# Altium project M7_DSP.PrjPcb (part 1 of 2)
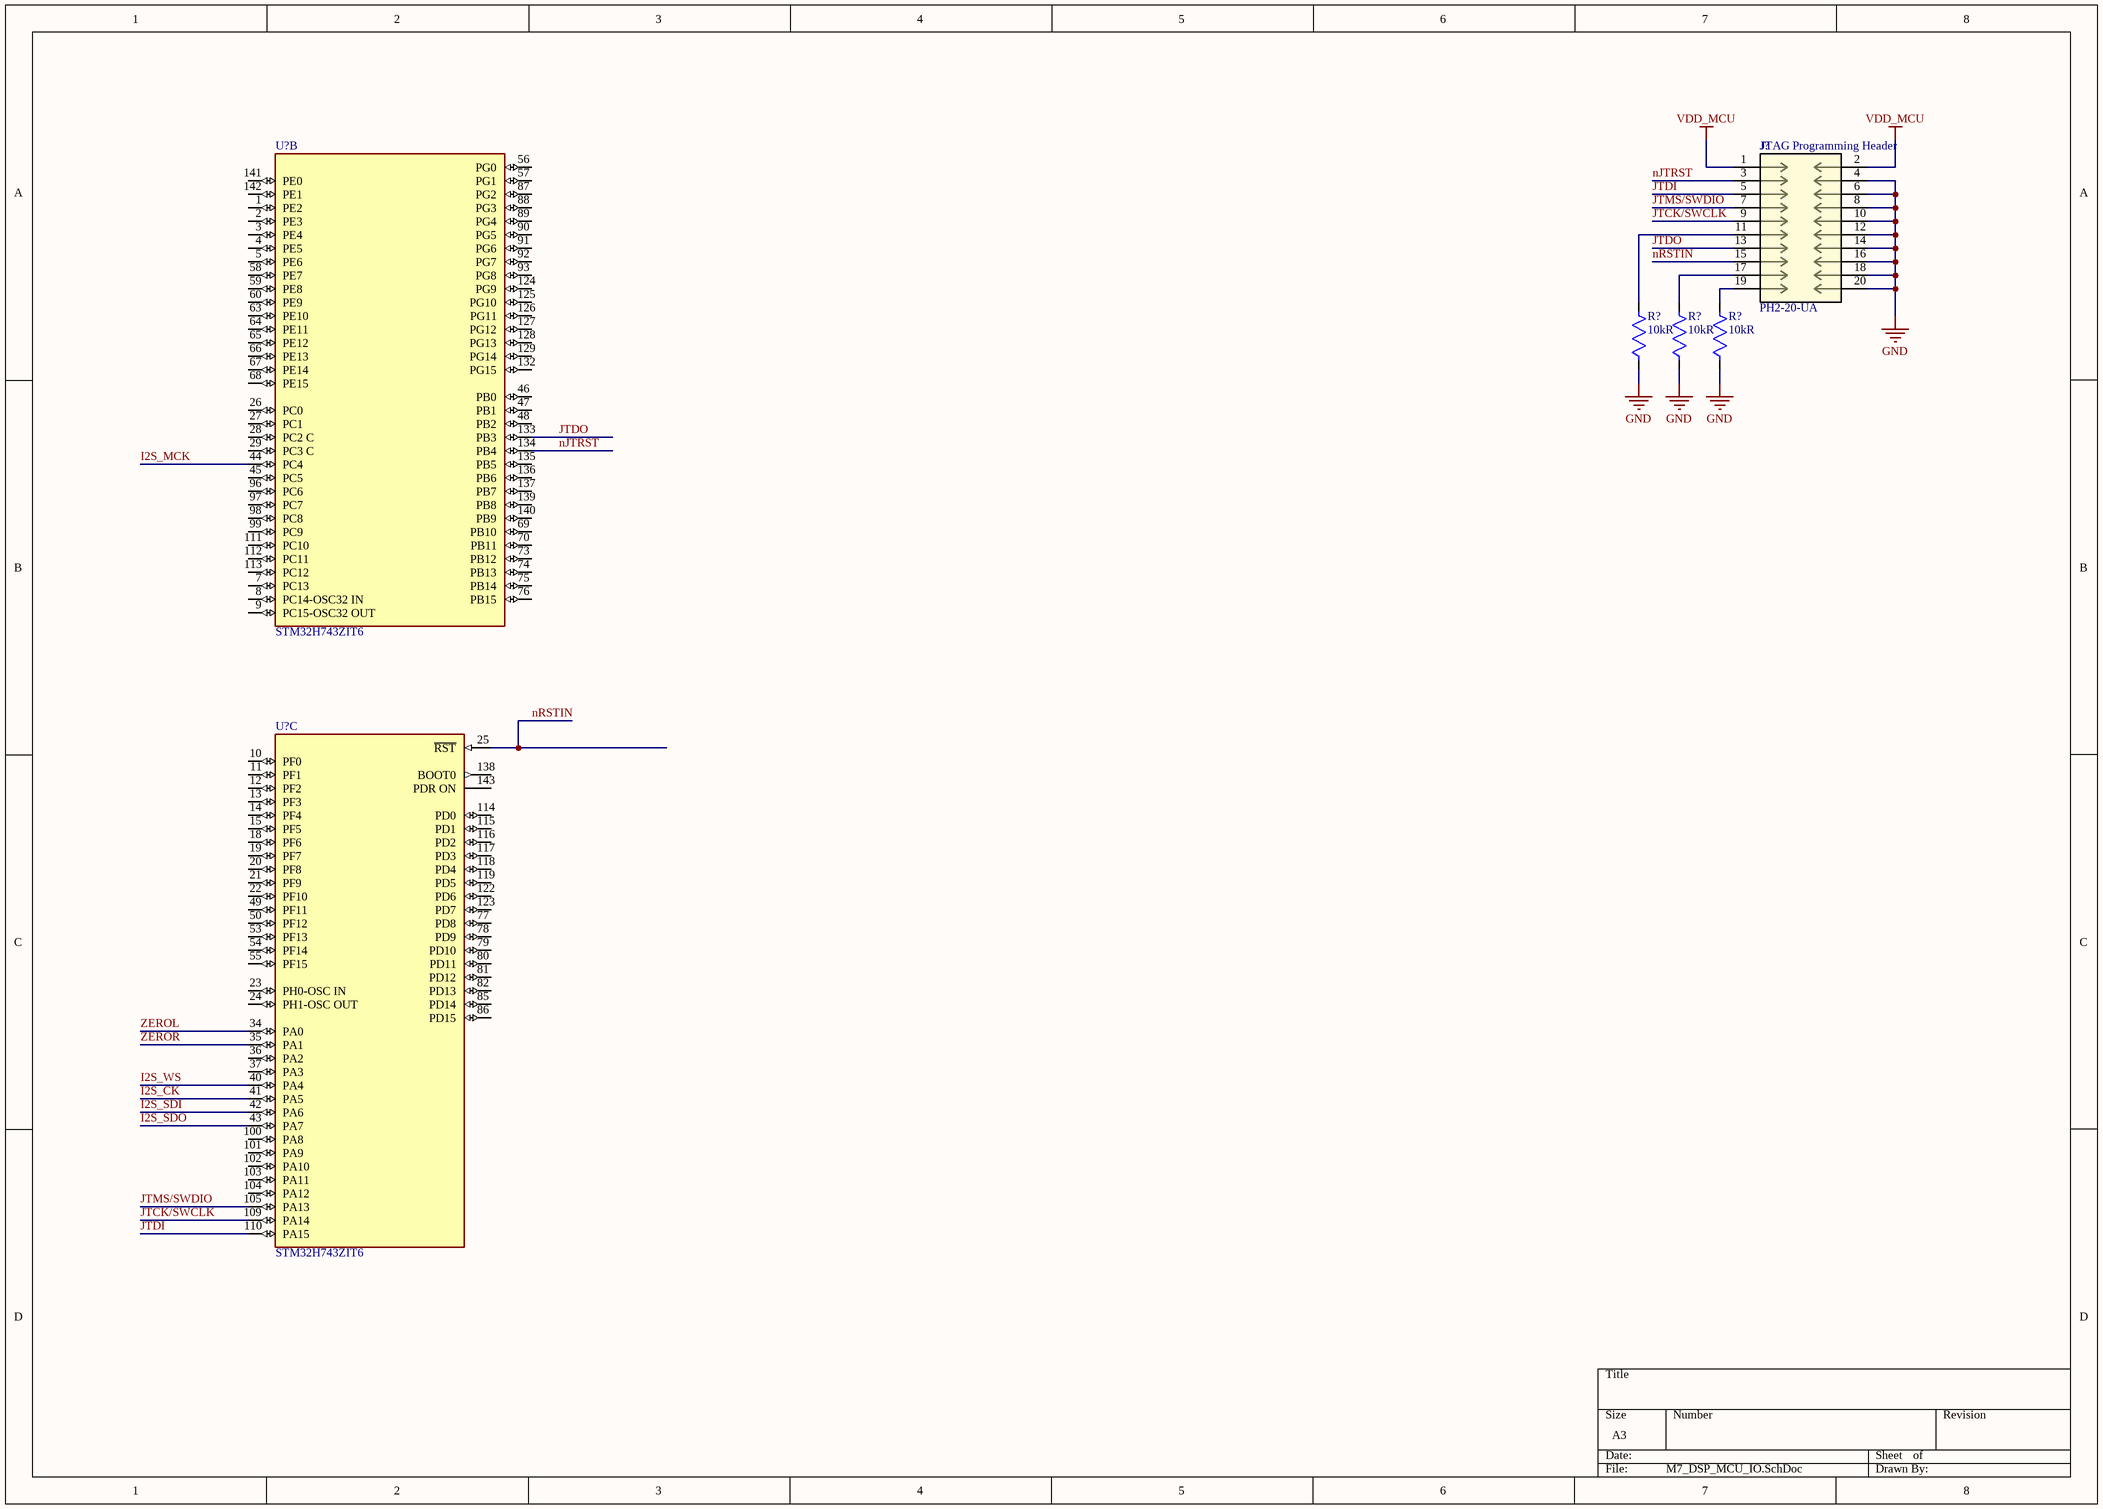
[diagram p0: M7_DSP_MCU_IO.SchDoc]
5 sheets, 96 parts. Net scope: global (net labels, ports and power ports of the same name join across sheets).
Sheets:
  M7_DSP_MCU_IO.SchDoc
  M7_DSP_MCU_Power.SchDoc
  M7_DSP_Power_Supply.SchDoc
  M7_DSP_Top_Sheet.SchDoc
  M7_DSP_Codec.SchDoc

## Sheet M7_DSP_MCU_IO.SchDoc
size A3; SheetNumber: 1; SheetTotal: 5

### Parts
(Parts that share a designator on the sheet are numbered #1, #2 ... from top to bottom, then left to right.)
J?  PH2-20-UA  [CONN_PH2-20-UA_ADM]
R?#1  Resistance: 10kR  [FP-AC0603-MFG]  (hidden comment: AC0603FR-0710KL)
R?#2  Resistance: 10kR  [FP-AC0603-MFG]  (hidden comment: AC0603FR-0710KL)
R?#3  Resistance: 10kR  [FP-AC0603-MFG]  (hidden comment: AC0603FR-0710KL)
U?#1  STM32H743ZIT6  [FP-LQFP144-1A-IPC_A]  (part B of 3)
U?#2  STM32H743ZIT6  [FP-LQFP144-1A-IPC_A]  (part C of 3)

### Nets
GND: J?.4 J?.6 J?.8 J?.10 J?.12 J?.14 J?.16 J?.18 J?.20 R?#1.1 R?#2.1 R?#3.1  [project net AGND]
VDD_MCU: J?.1 J?.2  [project net +3V3]
I2S_CK: U?#2.41(PA5)
I2S_MCK: U?#1.44(PC4)
I2S_SDI: U?#2.42(PA6)
I2S_SDO: U?#2.43(PA7)
I2S_WS: U?#2.40(PA4)
JTCK/SWCLK: J?.9 U?#2.109(PA14)
JTDI: J?.5 U?#2.110(PA15)
JTDO: J?.13 U?#1.133(PB3)
JTMS/SWDIO: J?.7 U?#2.105(PA13)
nJTRST: J?.3 U?#1.134(PB4)
nRSTIN: J?.15 U?#2.25(~{RST})
ZEROL: U?#2.34(PA0)
ZEROR: U?#2.35(PA1)
NetJ?_11: J?.11 R?#1.2
NetJ?_17: J?.17 R?#2.2
NetJ?_19: J?.19 R?#3.2

Not connected (* = marked no-connect by the designer): U?#1 1(PE2) 2(PE3) 3(PE4) 4(PE5) 5(PE6) 7(PC13) 8(PC14-OSC32_IN) 9(PC15-OSC32_OUT) 26(PC0) 27(PC1) 28(PC2_C) 29(PC3_C) 45(PC5) 46(PB0) 47(PB1) 48(PB2) 56(PG0) 57(PG1) 58(PE7) 59(PE8) 60(PE9) 63(PE10) 64(PE11) 65(PE12) 66(PE13) 67(PE14) 68(PE15) 69(PB10) 70(PB11) 73(PB12) 74(PB13) 75(PB14) 76(PB15) 87(PG2) 88(PG3) 89(PG4) 90(PG5) 91(PG6) 92(PG7) 93(PG8) 96(PC6) 97(PC7) 98(PC8) 99(PC9) 111(PC10) 112(PC11) 113(PC12) 124(PG9) 125(PG10) 126(PG11) 127(PG12) 128(PG13) 129(PG14) 132(PG15) 135(PB5) 136(PB6) 137(PB7) 139(PB8) 140(PB9) 141(PE0) 142(PE1); U?#2 10(PF0) 11(PF1) 12(PF2) 13(PF3) 14(PF4) 15(PF5) 18(PF6) 19(PF7) 20(PF8) 21(PF9) 22(PF10) 23(PH0-OSC_IN) 24(PH1-OSC_OUT) 36(PA2) 37(PA3) 49(PF11) 50(PF12) 53(PF13) 54(PF14) 55(PF15) 77(PD8) 78(PD9) 79(PD10) 80(PD11) 81(PD12) 82(PD13) 85(PD14) 86(PD15) 100(PA8) 101(PA9) 102(PA10) 103(PA11) 104(PA12) 114(PD0) 115(PD1) 116(PD2) 117(PD3) 118(PD4) 119(PD5) 122(PD6) 123(PD7) 138(BOOT0) 143(PDR_ON)

### Notes on the sheet
- (near J?) JTAG Programming Header

### Library data of the parts
J? = PH2-20-UA: Conn Unshrouded Header HDR 15 POS 2.54mm Solder ST Thru-Hole Bag; Mfr_Name: ADAM TECHNOLOGIES INC; Manufacturer: Adam Equipment; Number of Positions: 20; Type: DEV; Copyright: Copyright (C) 2024 Ultra Librarian. All rights reserved.; Manufacturer_Part_Number: PH2-20-UA; RefDes: RefDes; Supplier 1: Future Electronics; Manufacturer Part Number: PH2-20-UA; RoHS: Yes; Category: Connectors; Pricing 1: 1000=0.132, 3000=0.128, 5000=0.126, 15000=0.122, 25000=0.119 (USD); Mounting Technology: Through Hole; Contact Plating: Gold; Termination: Solder; Packaging: Bag; Pitch: 2.54mm; Lead Free: Lead Free; ComponentLink1URL: https://datasheet.ciiva.com/16479/page-312-315-16479356.pdf?src-supplier=Future+Electronics; ComponentLink1Description: https://datasheet.ciiva.com/16479/page-312-315-16479356.pdf?src-supplier=Future+Electronics; Supplier Part Number 1: 2074617
R?#1-R?#3 = CMP-2000-04818-3: RES 10KΩ 1.00% 0.1W 0603; Power Rating: 100mW; Tolerance: 1%; Voltage Rating: 50V; Temperature Coefficient: 100ppm/°C; Ratings: AEC-Q200; Case Code (Metric): 1608; Max Power Dissipation: 100mW; Height: 0.45mm; Package Quantity: 1; Max Operating Temperature: 155°C; Resistor Type: Thick Film; Depth: 0.8mm; RoHS Compliant: Yes; Min Operating Temperature: -55°C; Packaging: Tape and Reel; Number of Terminations: 2; Length: 1.6mm; Features: Moisture Resistant; Military Standard: Not; Case Code (Imperial): 0603; Size Code: 0603; Termination: SMD/SMT; Case/Package: 0603; Mount: Surface Mount; Width: 0.8mm; Lead Free: Lead Free; Series: AC; Construction: Rectangular; Supplier 1: Future Electronics; Supplier Part Number 1: 2029400
U?#1 U?#2 = CMP-12105-000003-1: IC MCU 32BIT 2MB FLASH 144LQFP; Manufacturer: STMicroelectronics; Number Of I2C Channels: 4; Number Of A/D Converters: 2; Standoff Height: 0.05mm; Interface: I2C,SPI,UART,USART,EBI/EMI,CAN,USB,LIN,IrDA,Other; Max Supply Voltage: 3.6V; Number Of Adc Channels: 36; Ram Size: 1MBytes; Number Of Cores: 1; Frequency: 400MHz; Data Bus Width: 32bits; Core Architecture: ARM Cortex-M7; Memory Size: 2MBytes; Number Of Timers/Counters: 22; Min Supply Voltage: 1.62V; Number Of Spi Channels: 6; Max Junction Temp: +125°C; Number Of I/Os: 114; Digikey Description: IC MCU 32BIT 2MB FLASH 144LQFP; Device Class L2: Embedded Processors and Controllers; Number Of Usb Channels: 2; ComponentLink2Description: Datasheet; Ipc Land Pattern Name: QFP50P2200X2200X160-144; Category: IC; Lead Free: Yes; Temperature Range High: +85°C; Mouser Description: MCU 32-Bit STM32 ARM Cortex M7 RISC 2MB Flash 1.8V/2.5V/3.3V 144-Pin LQFP Tray; RoHS: TRUE; Ambient Temperature Range Low: -40°C; Temperature Range Low: -40°C; ComponentLink2URL: https://www.st.com/resource/en/datasheet/stm32h743zi.pdf; Ambient Temperature Range High: +85°C; Octopart: https://octopart.com/stm32h743zit6-stmicroelectronics-76372529; Number Of Pwm Channels: 2; Height: 1.6mm; Manufacturer Part Number: STM32H743ZIT6; Device Class L3: Microcontrollers; Device Class L1: Integrated Circuits (ICs); Automotive: No; Memory Type: FLASH; Number Of Uart Channels: 4; Package: LQFP144-1A; Temperature: -40°C to +85°C; Supplier 1: Mouser; Supplier Part Number 1: 511-STM32H743ZIT6

## Sheet M7_DSP_MCU_Power.SchDoc
size A3; SheetNumber: 2; SheetTotal: 5
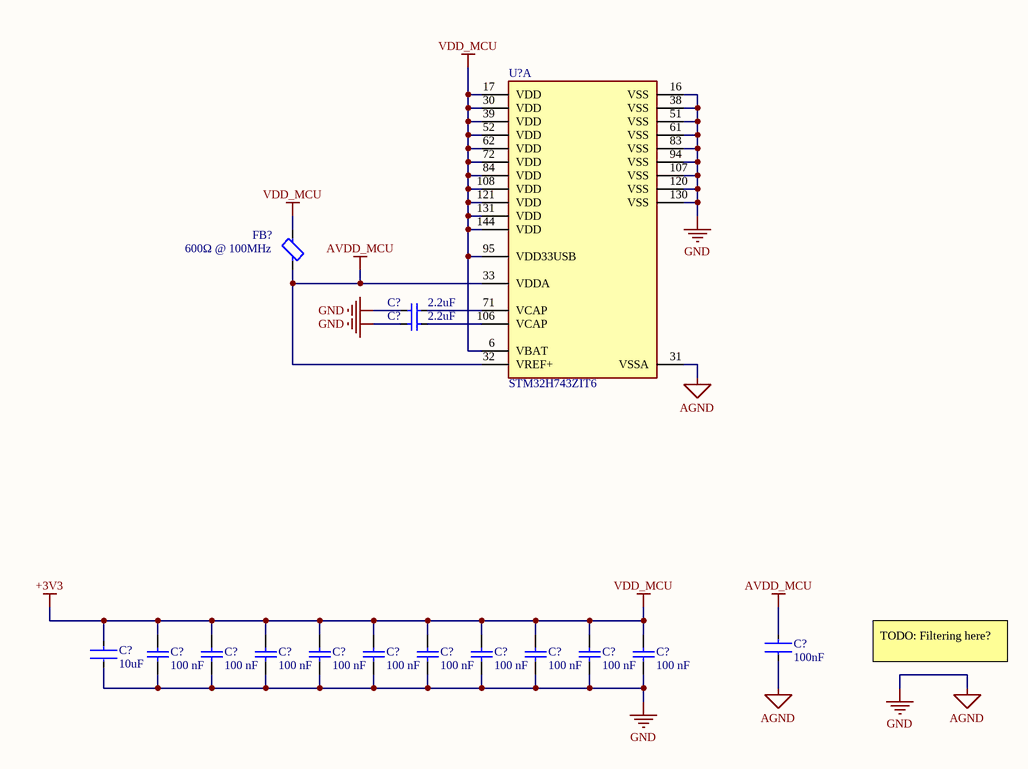
[diagram p1: M7_DSP_MCU_Power.SchDoc]

### Parts
(Parts that share a designator on the sheet are numbered #1, #2 ... from top to bottom, then left to right.)
C?#1  Capacitance: 2.2uF  [FP-CL10-IPC_A]  (hidden comment: CL10A225KO8NNNC)
C?#2  Capacitance: 2.2uF  [FP-CL10-IPC_A]  (hidden comment: CL10A225KO8NNNC)
C?#3  Capacitance: 100 nF  [CAPC1608X90X40ML10T20]  (hidden comment: CC0603ZRY5V9BB104)
C?#4  Capacitance: 100 nF  [CAPC1608X90X40ML10T20]  (hidden comment: CC0603ZRY5V9BB104)
C?#5  Capacitance: 100 nF  [CAPC1608X90X40ML10T20]  (hidden comment: CC0603ZRY5V9BB104)
C?#6  Capacitance: 100 nF  [CAPC1608X90X40ML10T20]  (hidden comment: CC0603ZRY5V9BB104)
C?#7  Capacitance: 100 nF  [CAPC1608X90X40ML10T20]  (hidden comment: CC0603ZRY5V9BB104)
C?#8  Capacitance: 100 nF  [CAPC1608X90X40ML10T20]  (hidden comment: CC0603ZRY5V9BB104)
C?#9  Capacitance: 100 nF  [CAPC1608X90X40ML10T20]  (hidden comment: CC0603ZRY5V9BB104)
C?#10  Capacitance: 100 nF  [CAPC1608X90X40ML10T20]  (hidden comment: CC0603ZRY5V9BB104)
C?#11  Capacitance: 100 nF  [CAPC1608X90X40ML10T20]  (hidden comment: CC0603ZRY5V9BB104)
C?#12  Capacitance: 100 nF  [CAPC1608X90X40ML10T20]  (hidden comment: CC0603ZRY5V9BB104)
C?#13  Capacitance: 100nF  [FP-0402-L_1_0_0_05-W_0_5-MFG]  (hidden comment: TMK105B7104MV-FR)
C?#14  value 10uF  [FP-GRM21B-0_2-e0_2_0_7-MFG]  (hidden comment: GRM21BC71E106ME11L)
FB?  MMZ1608B601CTAH0  [FP-MMZ1608-0_6-IPC_C]  (value not drawn)
U?#3  STM32H743ZIT6  [FP-LQFP144-1A-IPC_A]  (part A of 3)

### Nets
+3V3: C?#3.1 C?#4.1 C?#5.1 C?#6.1 C?#7.1 C?#8.1 C?#9.1 C?#10.1 C?#11.1 C?#12.1 C?#14.1 FB?.1 U?#3.6(VBAT) U?#3.17(VDD) U?#3.30(VDD) U?#3.39(VDD) U?#3.52(VDD) U?#3.62(VDD) U?#3.72(VDD) U?#3.84(VDD) U?#3.95(VDD33USB) U?#3.108(VDD) U?#3.121(VDD) U?#3.131(VDD) U?#3.144(VDD)  [also labelled VDD_MCU]
AGND: C?#1.2 C?#2.2 C?#3.2 C?#4.2 C?#5.2 C?#6.2 C?#7.2 C?#8.2 C?#9.2 C?#10.2 C?#11.2 C?#12.2 C?#13.2 C?#14.2 U?#3.16(VSS) U?#3.31(VSSA) U?#3.38(VSS) U?#3.51(VSS) U?#3.61(VSS) U?#3.83(VSS) U?#3.94(VSS) U?#3.107(VSS) U?#3.120(VSS) U?#3.130(VSS)  [also labelled GND]
AVDD_MCU: C?#13.1 FB?.2 U?#3.32(VREF+) U?#3.33(VDDA)
NetC?#1_1: C?#1.1 U?#3.71(VCAP)
NetC?#2_1: C?#2.1 U?#3.106(VCAP)

### Notes on the sheet
- (near FB?) 600Ω @ 100MHz
- TODO: Filtering here?

### Library data of the parts
C?#1 C?#2 = CMP-13271-000835-1: Cap Ceramic 2.2uF 16V X5R ±10% Pad SMD 0603 +85°C T/R; Case Code (Metric): 1608; Height: 0.8mm; Case/Package: 0603; Depth: 0.8mm; Voltage Rating: 16V; Case Code (Imperial): 0603; Length: 1.6mm; Packaging: Tape and Reel; Material: Ceramic; Lead Free: Lead Free; Max Operating Temperature: 85°C; Contact Plating: Tin; Thickness: 0.035inch; Radiation Hardening: No; Tolerance: 10%; Min Operating Temperature: -55°C; Voltage: 16V; Dielectric: X5R; Mount: Surface Mount; Package Quantity: 4000; Width: 0.031inch; Voltage Rating (DC): 16V; Supplier 1: Rs; Supplier Part Number 1: 7664799
C?#3-C?#12 = CMP-1035-02594-2: Chip Capacitor, 100 nF, - 20% to + 80%, 50 V, -30 to 85 degC, 0603 (1608 Metric), RoHS, Tape and Reel; Manufacturer: Yageo; Tolerance: -20%,+80%; Product Training Modules: MultilayerCeramicCapacitors; Temperature Coefficient: Y5V(F); Kits: CC060300000000000-ND-MLCC0603SAMPLEKIT; Other Names: 311-1343-1; Featured Product: CommodityMultilayerCeramicCapacitors–CCSeries; Online Catalog: CCSeries; Voltage - Rated: 50V; Mounting Type: SurfaceMount,MLCC; Package Description: 2-Pin Surface Mount Device, Body 1.6 x 0.8 mm; Ratings: -; Lead Spacing: -; Standard Package: 1; Applications: GeneralPurpose; Size / Dimension: 0.063"Lx0.031"W(1.60mmx0.80mm); Package Reference: 0603; Operating Temperature: -30°C~85°C; Features: -; Height - Seated (Max): -; Thickness (Max): 0.035"(0.90mm); Series: CC; Datasheet URL: https://datasheet.ciiva.com/17434/upy-gphc-y5v-6-3v-to-50v-5-17434523.pdf; Family: CeramicCapacitors; Mounting Technology: SurfaceMount; Packaging: CutTape(CT); Package / Case: 0603(1608Metric); Manufacturer URL: http://www.yageo.com/; Category: Capacitors; Lead Style: -; Datasheet Version: Rev. 5, 07/2010; Supplier 1: Rs; Supplier Part Number 1: 6169565
C?#13 = CMP-14477-003834-2: Multilayer Ceramic Capacitors (High dielectric type), 25V, 0.1 uF, ± 20 %, 0402, X7R, RoHS; Manufacturer: Taiyo Yuden; Tolerance: 20%; Value: 100nF; Min Operating Temperature: -55°C; Voltage Rating: 25V; Max Operating Temperature: 125°C; Mount: Surface Mount; RoHS Compliant: Yes; Case/Package: 0402; Packaging: Tape and Reel; Supplier 1: Avnet; Manufacturer Part Number: TMK105B7104MV-FR; RoHS: Yes; Category: Ceramic Capacitors; Stock 1: 20000; Pricing 1: 10000=0.00533, 20000=0.00524, 40000=0.00515, 60000=0.00506, 80000=0.00497 (USD); Mounting Technology: Surface Mount; Series: M; ComponentLink1URL: http://ds.yuden.co.jp/TYCOMPAS/ut/detail.do?productNo=TMK105B7104MV-FR&amp;fileName=TMK105B7104MV-FR_SS&amp;mode=specSheetDownload&src-supplier=Digikey; ComponentLink1Description: http://ds.yuden.co.jp/TYCOMPAS/ut/detail.do?productNo=TMK105B7104MV-FR&amp;fileName=TMK105B7104MV-FR_SS&amp;mode=specSheetDownload&src-supplier=Digikey; Supplier Part Number 1: TMK105B7104MV-FR
C?#14 = GRM21BC71E106ME11L: Multilayer Ceramic Capacitors MLCC - SMD/SMT 0805 10uF 25volts *Derate Voltage/Temp; Manufacturer: Murata; Voltage Rating: 25V; Tolerance: 20%; Dielectric: X7S; Manufacturer Part Number: GRM21BC71E106ME11L; RoHS: Yes; Category: Ceramic Capacitors; Stock 1: 6000; Pricing 1: 3000=0.1097, 9000=0.0994, 24000=0.097, 45000=0.0923 (USD); Mounting Technology: Surface Mount; Case/Package: 0805; Case Code (Metric): 2012; Case Code (Imperial): 0805; Weight: 0.000335oz; Min Operating Temperature: -55°C; Max Operating Temperature: 125°C; Packaging: Tape and Reel; Termination: SMD/SMT; Voltage Rating (DC): 25V; Package Quantity: 3000; Series: GRM; Length: 0.079inch; Width: 0.049inch; Height: 1.25mm; Thickness: 0.057inch; RoHS Compliant: Yes; ComponentLink1URL: http://www.mouser.com/ds/2/281/c02e-2905.pdf?src-supplier=Mouser; ComponentLink1Description: http://www.mouser.com/ds/2/281/c02e-2905.pdf?src-supplier=Mouser; ComponentLink2URL: http://search.murata.co.jp/Ceramy/image/img/A01X/G101/ENG/GRM21BC71E106ME11-01.pdf?src-supplier=Digikey; ComponentLink2Description: http://search.murata.co.jp/Ceramy/image/img/A01X/G101/ENG/GRM21BC71E106ME11-01.pdf?src-supplier=Digikey; ComponentLink3URL: http://search.murata.co.jp/Ceramy/image/img/A01X/partnumbering_e_01.pdf?src-supplier=Digikey; ComponentLink3Description: http://search.murata.co.jp/Ceramy/image/img/A01X/partnumbering_e_01.pdf?src-supplier=Digikey; ComponentLink4URL: https://datasheet.octopart.com/GRM21BC71E106ME11L-Murata-datasheet-149523451.pdf?src-supplier=Newark; ComponentLink4Description: https://datasheet.octopart.com/GRM21BC71E106ME11L-Murata-datasheet-149523451.pdf?src-supplier=Newark; ComponentLink5URL: https://datasheet.octopart.com/GRM21BC71E106ME11L-Murata-datasheet-32479577.pdf?src-supplier=Future+Electronics; ComponentLink5Description: https://datasheet.octopart.com/GRM21BC71E106ME11L-Murata-datasheet-32479577.pdf?src-supplier=Future+Electronics; Supplier Part Number 1: GRM21BC71E106ME11L; Supplier 1: Arrow Electronics
FB? = CMP-08257-000106-1: Signal Line Ferrite Bead 600 Ω 100MHz 500mA DCR 400mΩ SMD 0603; Tolerance: 25%; Impedance: 600R; DC Resistance (DCR): 400mR; Packaging: Cut Tape; Depth: 0.8mm; Case Code (Metric): 1608; Mount: Surface Mount; REACH SVHC: No SVHC; Case/Package: 0603; Max DC Current: 500mA; Height: 0.03inch; Case Code (Imperial): 0603; Package Quantity: 1; RoHS Compliant: Yes; Core Material: Ferrite; Length: 0.063inch; Current Rating: 500mA; Width: 0.031inch; Supplier 1: Rs; Supplier Part Number 1: 7865015
U?#3 = CMP-12105-000003-1: as U?#1 on sheet M7_DSP_MCU_IO; Digikey Description: IC MCU 32BIT 2MB FLASH 144LQFP; Device Class L2: Embedded Processors and Controllers; Number Of Usb Channels: 2; ComponentLink2Description: Datasheet; Ipc Land Pattern Name: QFP50P2200X2200X160-144; Category: IC; Lead Free: Yes; Temperature Range High: +85°C; Mouser Description: MCU 32-Bit STM32 ARM Cortex M7 RISC 2MB Flash 1.8V/2.5V/3.3V 144-Pin LQFP Tray; RoHS: TRUE; Ambient Temperature Range Low: -40°C; Temperature Range Low: -40°C; ComponentLink2URL: https://www.st.com/resource/en/datasheet/stm32h743zi.pdf; Ambient Temperature Range High: +85°C; Octopart: https://octopart.com/stm32h743zit6-stmicroelectronics-76372529; Number Of Pwm Channels: 2; Height: 1.6mm; Manufacturer Part Number: STM32H743ZIT6; Device Class L3: Microcontrollers; Device Class L1: Integrated Circuits (ICs); Automotive: No; Memory Type: FLASH; Number Of Uart Channels: 4; Package: LQFP144-1A; Temperature: -40°C to +85°C; Supplier 1: Mouser; Supplier Part Number 1: 511-STM32H743ZIT6

## Sheet M7_DSP_Power_Supply.SchDoc
size A3; SheetNumber: 3; SheetTotal: 5
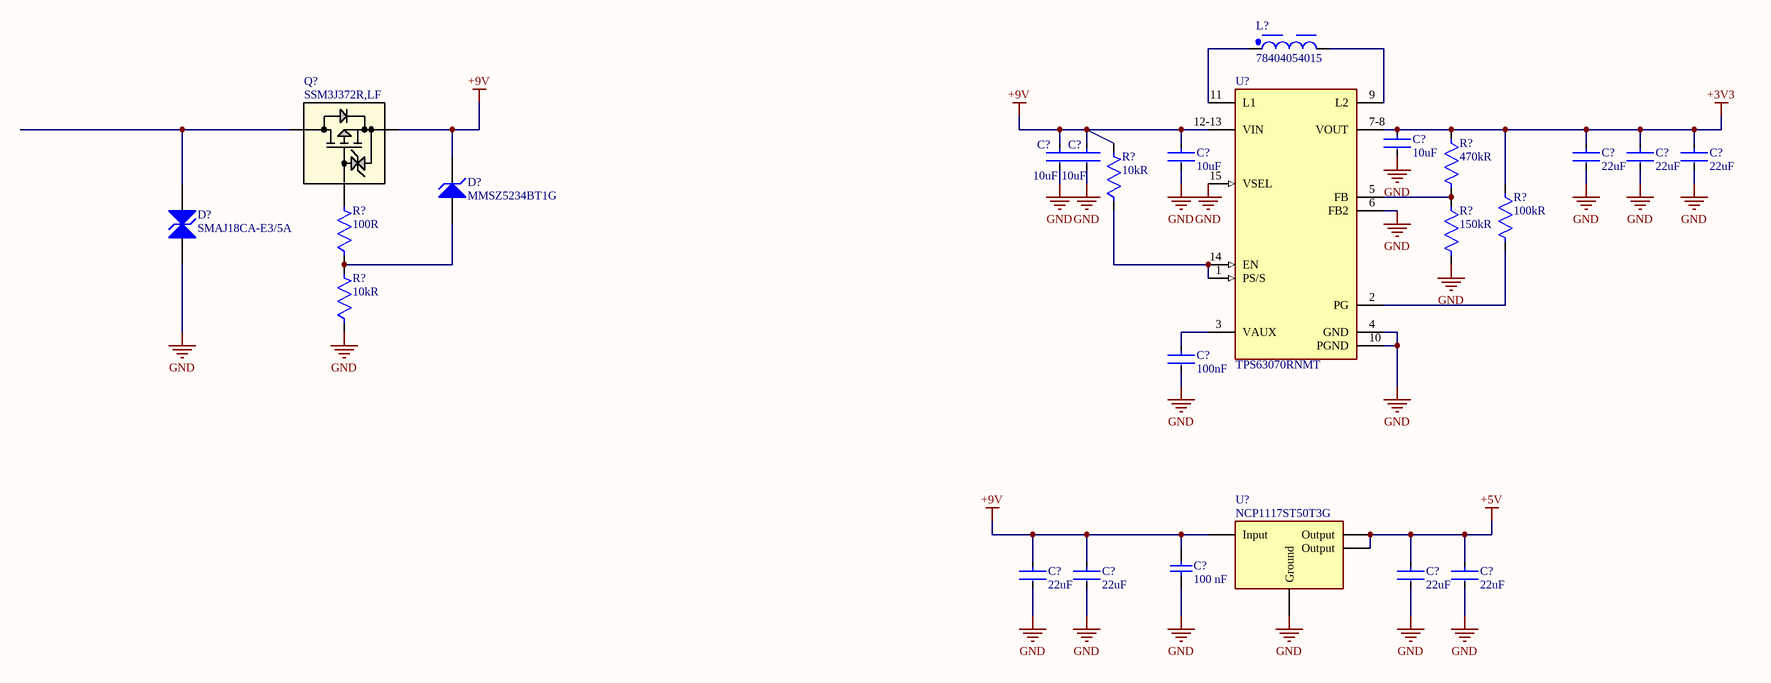
[diagram p2: M7_DSP_Power_Supply.SchDoc]

### Parts
(Parts that share a designator on the sheet are numbered #1, #2 ... from top to bottom, then left to right.)
C?#15  Capacitance: 10uF  [FP-0603-L_1_6_0_2-W_0_8_0-MFG]  (hidden comment: TMK107BBJ106MA-T)
C?#16  value 10uF  [FP-GRM21B-0_2-e0_2_0_7-MFG]  (hidden comment: GRM21BC71E106ME11L)
C?#17  value 10uF  [FP-GRM21B-0_2-e0_2_0_7-MFG]  (hidden comment: GRM21BC71E106ME11L)
C?#18  Capacitance: 10uF  [FP-0603-L_1_6_0_2-W_0_8_0-MFG]  (hidden comment: TMK107BBJ106MA-T)
C?#19  Capacitance: 22uF  [FP-GRM21B-0_2-e0_2_0_7-MFG]  (hidden comment: GRM21BC81C226ME44L)
C?#20  Capacitance: 22uF  [FP-GRM21B-0_2-e0_2_0_7-MFG]  (hidden comment: GRM21BC81C226ME44L)
C?#21  Capacitance: 22uF  [FP-GRM21B-0_2-e0_2_0_7-MFG]  (hidden comment: GRM21BC81C226ME44L)
C?#22  Capacitance: 100nF  [FP-0402-L_1_0_0_05-W_0_5-MFG]  (hidden comment: TMK105B7104MV-FR)
C?#23  Capacitance: 100 nF  [CAPC1608X90X40ML10T20]  (hidden comment: CC0603ZRY5V9BB104)
C?#24  Capacitance: 22uF  [FP-GRM21B-0_2-e0_2_0_7-MFG]  (hidden comment: GRM21BC81C226ME44L)
C?#25  Capacitance: 22uF  [FP-GRM21B-0_2-e0_2_0_7-MFG]  (hidden comment: GRM21BC81C226ME44L)
C?#26  Capacitance: 22uF  [FP-GRM21B-0_2-e0_2_0_7-MFG]  (hidden comment: GRM21BC81C226ME44L)
C?#27  Capacitance: 22uF  [FP-GRM21B-0_2-e0_2_0_7-MFG]  (hidden comment: GRM21BC81C226ME44L)
D?#1  MMSZ5234BT1G  [ONSC-SOD-123-2-425-04_V]
D?#2  SMAJ18CA-E3/5A  [VISH-DO-214AC-2_L]
L?  78404054015  [WE-LQSA_5040]
Q?  SSM3J372R,LF  [SOT-23F_TOS]
R?#4  Resistance: 470kR  [FP-AC0603-MFG]  (hidden comment: AC0603FR-07470KL)
R?#5  Resistance: 100kR  [FP-AC0603-MFG]  (hidden comment: AC0603FR-07100KL)
R?#6  Resistance: 150kR  [FP-AC0603-MFG]  (hidden comment: AC0603FR-07150KL)
R?#7  Resistance: 10kR  [FP-AC0603-MFG]  (hidden comment: AC0603FR-0710KL)
R?#8  Resistance: 100R  [FP-AC0603-MFG]  (hidden comment: AC0603FR-07100RL)
R?#9  Resistance: 10kR  [FP-AC0603-MFG]  (hidden comment: AC0603FR-0710KL)
U?#4  TPS63070RNMT  [FP-RNM0015A-MFG]
U?#5  NCP1117ST50T3G  [FP-318H-MFG]

### Nets
+3V3: C?#15.1 C?#19.1 C?#20.1 C?#21.1 R?#4.1 R?#5.1 U?#4.7-8(VOUT)
+5V: C?#26.1 C?#27.1 U?#5.2(Output) U?#5.4(Output)
+9V: C?#16.1 C?#17.1 C?#18.1 C?#23.1 C?#24.1 C?#25.1 D?#1.1(K) Q?.2 R?#7.2 U?#4.12-13(VIN) U?#5.3(Input)
GND: C?#15.2 C?#16.2 C?#17.2 C?#18.2 C?#19.2 C?#20.2 C?#21.2 C?#22.2 C?#23.2 C?#24.2 C?#25.2 C?#26.2 C?#27.2 D?#2.1(A1) R?#6.2 R?#9.1 U?#4.4(GND) U?#4.6(FB2) U?#4.10(PGND) U?#4.15(VSEL) U?#5.1(Ground)  [project net AGND]
NetC?#22_1: C?#22.1 U?#4.3(VAUX)
NetD?#1_2: D?#1.2(A) R?#8.1 R?#9.2
NetD?#2_2: D?#2.2(A2) Q?.3
NetL?_1: L?.1 U?#4.11(L1)
NetL?_2: L?.2 U?#4.9(L2)
NetQ?_1: Q?.1 R?#8.2
NetR?#4_2: R?#4.2 R?#6.1 U?#4.5(FB)
NetR?#5_2: R?#5.2 U?#4.2(PG)
NetR?#7_1: R?#7.1 U?#4.1(PS/S) U?#4.14(EN)

### Library data of the parts
C?#15 C?#18 = CMP-14477-005164-2: Multilayer Ceramic Capacitor 10uF 25V X5R 20% SMD 0603 T/R; Packaging: Tape and Reel; Tolerance: 20%; Mount: Surface Mount; Case Code (Metric): 1608; Case Code (Imperial): 0603; Min Operating Temperature: -55°C; Lead Free: Lead Free; RoHS Compliant: Yes; Case/Package: 0603; Max Operating Temperature: 85°C; Voltage Rating: 25V; Supplier 1: Rs; Supplier Part Number 1: 1782887
C?#16 C?#17 = GRM21BC71E106ME11L: as C?#14 on sheet M7_DSP_MCU_Power; Manufacturer Part Number: GRM21BC71E106ME11L; RoHS: Yes; Category: Ceramic Capacitors; Stock 1: 6000; Pricing 1: 3000=0.1097, 9000=0.0994, 24000=0.097, 45000=0.0923 (USD); Mounting Technology: Surface Mount; Case/Package: 0805; Case Code (Metric): 2012; Case Code (Imperial): 0805; Weight: 0.000335oz; Min Operating Temperature: -55°C; Max Operating Temperature: 125°C; Packaging: Tape and Reel; Termination: SMD/SMT; Voltage Rating (DC): 25V; Package Quantity: 3000; Series: GRM; Length: 0.079inch; Width: 0.049inch; Height: 1.25mm; Thickness: 0.057inch; RoHS Compliant: Yes; ComponentLink1URL: http://www.mouser.com/ds/2/281/c02e-2905.pdf?src-supplier=Mouser; ComponentLink1Description: http://www.mouser.com/ds/2/281/c02e-2905.pdf?src-supplier=Mouser; ComponentLink2URL: http://search.murata.co.jp/Ceramy/image/img/A01X/G101/ENG/GRM21BC71E106ME11-01.pdf?src-supplier=Digikey; ComponentLink2Description: http://search.murata.co.jp/Ceramy/image/img/A01X/G101/ENG/GRM21BC71E106ME11-01.pdf?src-supplier=Digikey; ComponentLink3URL: http://search.murata.co.jp/Ceramy/image/img/A01X/partnumbering_e_01.pdf?src-supplier=Digikey; ComponentLink3Description: http://search.murata.co.jp/Ceramy/image/img/A01X/partnumbering_e_01.pdf?src-supplier=Digikey; ComponentLink4URL: https://datasheet.octopart.com/GRM21BC71E106ME11L-Murata-datasheet-149523451.pdf?src-supplier=Newark; ComponentLink4Description: https://datasheet.octopart.com/GRM21BC71E106ME11L-Murata-datasheet-149523451.pdf?src-supplier=Newark; ComponentLink5URL: https://datasheet.octopart.com/GRM21BC71E106ME11L-Murata-datasheet-32479577.pdf?src-supplier=Future+Electronics; ComponentLink5Description: https://datasheet.octopart.com/GRM21BC71E106ME11L-Murata-datasheet-32479577.pdf?src-supplier=Future+Electronics; Supplier Part Number 1: GRM21BC71E106ME11L; Supplier 1: Arrow Electronics
C?#19-C?#21 C?#24-C?#27 = CMP-06035-012913-1: Chip Multilayer Ceramic Capacitors for General Purpose, 0805, 22uF, X6S, 22%, 20%, 16V; Packaging: Tape and Reel; Dielectric: X6S; Case Code (Imperial): 0805; Weight: 0.000335oz; Case Code (Metric): 2012; Thickness: 0.057inch; Min Operating Temperature: -55°C; Voltage Rating (DC): 16V; Tolerance: 20%; Width: 1.25mm; Voltage Rating: 16V; Mount: Surface Mount; Length: 0.079inch; Lead Free: Lead Free; Case/Package: 0805; Package Quantity: 3000; Height: 1.25mm; Max Operating Temperature: 105°C; Termination: SMD/SMT; Supplier 1: Rs; Supplier Part Number 1: 2478094
C?#22 = CMP-14477-003834-2: as C?#13 on sheet M7_DSP_MCU_Power; Min Operating Temperature: -55°C; Voltage Rating: 25V; Max Operating Temperature: 125°C; Mount: Surface Mount; RoHS Compliant: Yes; Case/Package: 0402; Packaging: Tape and Reel; Supplier 1: Avnet; Manufacturer Part Number: TMK105B7104MV-FR; RoHS: Yes; Category: Ceramic Capacitors; Stock 1: 20000; Pricing 1: 10000=0.00533, 20000=0.00524, 40000=0.00515, 60000=0.00506, 80000=0.00497 (USD); Mounting Technology: Surface Mount; Series: M; ComponentLink1URL: http://ds.yuden.co.jp/TYCOMPAS/ut/detail.do?productNo=TMK105B7104MV-FR&amp;fileName=TMK105B7104MV-FR_SS&amp;mode=specSheetDownload&src-supplier=Digikey; ComponentLink1Description: http://ds.yuden.co.jp/TYCOMPAS/ut/detail.do?productNo=TMK105B7104MV-FR&amp;fileName=TMK105B7104MV-FR_SS&amp;mode=specSheetDownload&src-supplier=Digikey; Supplier Part Number 1: TMK105B7104MV-FR
C?#23 = CMP-1035-02594-2: as C?#3 on sheet M7_DSP_MCU_Power; Mounting Type: SurfaceMount,MLCC; Package Description: 2-Pin Surface Mount Device, Body 1.6 x 0.8 mm; Ratings: -; Lead Spacing: -; Standard Package: 1; Applications: GeneralPurpose; Size / Dimension: 0.063"Lx0.031"W(1.60mmx0.80mm); Package Reference: 0603; Operating Temperature: -30°C~85°C; Features: -; Height - Seated (Max): -; Thickness (Max): 0.035"(0.90mm); Series: CC; Datasheet URL: https://datasheet.ciiva.com/17434/upy-gphc-y5v-6-3v-to-50v-5-17434523.pdf; Family: CeramicCapacitors; Mounting Technology: SurfaceMount; Packaging: CutTape(CT); Package / Case: 0603(1608Metric); Manufacturer URL: http://www.yageo.com/; Category: Capacitors; Lead Style: -; Datasheet Version: Rev. 5, 07/2010; Supplier 1: Rs; Supplier Part Number 1: 6169565
D?#1 = CMP-1060-00589-1: Zener Voltage Regulator, 500 mW, 2-Pin SOD-123, Pb-Free, Tape and Reel; Manufacturer: On Semiconductor; P Max (W): 0.5; VZ Typ (V): 6.2; ComponentLink3Description: Package Specification; PartNumber: MMSZ5234BT1G; ComponentLink2Description: Datasheet; Packing: Tape and Reel; Mounting Technology: Surface Mount; ComponentLink3URL: http://www.onsemi.com/pub_link/Collateral/425-04.PDF; DatasheetVersion: Rev. 12; ComponentLink1Description: Manufacturer URL; PackageDescription: 2-Pin SOD, Body 1.6 x 2.69 mm; PackageVersion: Rev. G, 10/2009; ComponentLink2URL: http://www.onsemi.com/pub_link/Collateral/MMSZ5221BT1-D.PDF; RoHS: Pb-Free; ComponentLink1URL: http://www.onsemi.com/; PackageReference: SOD-123-2-425-04; Supplier 1: Future Electronics; Supplier Part Number 1: 5159872
D?#2 = CMP-0548-00266-2: Transient Voltage Suppressor, 6.40 to 231 V, 18 V Stand-off Voltage, Bi-Directional, -55 to 155 degC, 2-pin DO-214AC, Pb-Free, Tape and Reel; Manufacturer: Vishay Semiconductor; VWM (V): 18; VBR Bi-Directional (V): 6.4 to 231; ID (uA): 2; IFSM: 40 A; PPPM (W): 400, 300; ComponentLink1URL: http://www.vishay.com/; PackageDescription: 2-Pin DO-214AC (SMA), Body 4.245 x 2.665 mm; ComponentLink2URL: http://www.vishay.com/docs/88390/smaj50a.pdf; Packing: Tape and Reel; DatasheetVersion: 12/8/2013; RoHS: TRUE; ComponentLink2Description: Datasheet; Mounting Technology: Surface Mount; PackageReference: DO-214AC-2; PartNumber: SMAJ18CA-E3/5A; ComponentLink1Description: Manufacturer URL; Operating Junction and Storage Temperature Range: -55 to 150 degC; ComponentLink3Description: Package Specification; ComponentLink3URL: http://www.vishay.com/docs/88390/smaj50a.pdf; Supplier 1: Mouser; Supplier Part Number 1: 625-SMAJ18CA-E3/5A
L? = CMP-03913-130031011-1: 78404054015 Power Inductor, Smd, 1.5Uh, 5.22A Rohs Compliant: Yes |Wurth Elektronik 78404054015; DC Resistance (DCR): 15mΩ; Inductance: 1.5µH; Voltage Rating: 80V; Height: 4mm; Current Rating: 5.22A; RoHS: Compliant; Width: 5mm; NexarPartId: 130031011; Max Operating Temperature: 150°C; Ambient Temperature Range High: 100°C; Length: 5mm; Min Operating Temperature: -50°C; Ambient Temperature Range Low: -50°C; Supplier 1: Rs; Supplier Part Number 1: 2591077P
Q? = SSM3J372R,LF: Mosfet P-ch 30V 6A SOT23F; Mfr_Name: Toshiba Electronic Devices & Storage Corp.; Manufacturer: Toshiba; Type: DEV; Copyright: Copyright (C) 2024 Ultra Librarian. All rights reserved.; Manufacturer_Part_Number: SSM3J372R,LF; RefDes: RefDes; Supplier 1: Mouser; Manufacturer Part Number: SSM3J372R,LF; RoHS: No; Stock 1: 871; Pricing 1: 1=0.3873, 10=0.294, 25=0.2912, 100=0.1497, 250=0.1482, 500=0.0889 (USD); Supplier Part Number 1: 757-SSM3J372RLF
R?#4 = CMP-03412-003482-2: RES 470KΩ 1.00% 0.1W 0603; Voltage Rating: 50V; Max Power Dissipation: 100mW; Tolerance: 1%; Temperature Coefficient: 100ppm/°C; RoHS Compliant: Yes; Width: 0.8mm; Military Standard: Not; Number of Terminations: 2; Case/Package: 0603; Min Operating Temperature: -55°C; Length: 1.6mm; Construction: Rectangular; Power Rating: 100mW; Ratings: AEC-Q200; Height: 0.45mm; Packaging: Tape and Reel; Case Code (Imperial): 0603; Case Code (Metric): 1608; Termination: SMD/SMT; Max Operating Temperature: 155°C; Features: Moisture Resistant; Series: AC; Depth: 0.8mm; Resistor Type: Thick Film; Supplier 1: Future Electronics; Supplier Part Number 1: 7097719
R?#5 = CMP-2000-04816-3: RES 100KΩ 1.00% 0.1W 0603; Temperature Coefficient: 100ppm/°C; Voltage Rating: 50V; Max Power Dissipation: 100mW; Tolerance: 1%; Working Voltage: 75V; Min Operating Temperature: -55°C; Case Code (Imperial): 0603; Width: 0.031inch; Max Operating Temperature: 155°C; Military Standard: Not; Technology: THICK FILM; Ratings: AEC-Q200; Features: Moisture Resistant; Construction: Rectangular; Resistor Type: Thick Film; RoHS Compliant: Yes; Case Code (Metric): 1608; Termination: SMD/SMT; Series: AC; Lead Free: Lead Free; Length: 1.6mm; Depth: 0.8mm; Height: 0.022inch; Power Rating: 100mW; Package Quantity: 1; Packaging: Tape and Reel; Case/Package: 0603; Number of Terminations: 2; Moisture Sensitivity Level: 1; Supplier 1: Future Electronics; Supplier Part Number 1: 6029288
R?#6 = CMP-03412-018794-2: RES 150KΩ 1.00% 0.1W 0603; Power Rating: 100mW; Voltage Rating: 50V; Tolerance: 1%; Temperature Coefficient: 100ppm/°C; Ratings: AEC-Q200; Resistor Type: Thick Film; Series: AC; Termination: SMD/SMT; Width: 0.8mm; Weight: 7.1E-05oz; Height: 0.45mm; Min Operating Temperature: -55°C; Number of Terminations: 2; RoHS Compliant: Yes; Length: 1.6mm; Case Code (Metric): 1608; Features: Moisture Resistant; Max Power Dissipation: 100mW; Case Code (Imperial): 0603; Case/Package: 0603; Max Operating Temperature: 155°C; Packaging: Tape and Reel; Supplier 1: Future Electronics; Supplier Part Number 1: 5095701
R?#7 R?#9 = CMP-2000-04818-3: as R?#1 on sheet M7_DSP_MCU_IO; Ratings: AEC-Q200; Case Code (Metric): 1608; Max Power Dissipation: 100mW; Height: 0.45mm; Package Quantity: 1; Max Operating Temperature: 155°C; Resistor Type: Thick Film; Depth: 0.8mm; RoHS Compliant: Yes; Min Operating Temperature: -55°C; Packaging: Tape and Reel; Number of Terminations: 2; Length: 1.6mm; Features: Moisture Resistant; Military Standard: Not; Case Code (Imperial): 0603; Size Code: 0603; Termination: SMD/SMT; Case/Package: 0603; Mount: Surface Mount; Width: 0.8mm; Lead Free: Lead Free; Series: AC; Construction: Rectangular; Supplier 1: Future Electronics; Supplier Part Number 1: 2029400
R?#8 = CMP-2000-04817-3: RES 100Ω 1.00% 0.1W 0603; Temperature Coefficient: 100ppm/°C; Voltage Rating: 50V; Max Power Dissipation: 100mW; Tolerance: 1%; Series: AC; Height: 0.45mm; Max Operating Temperature: 155°C; Depth: 0.8mm; Lead Free: Lead Free; Packaging: Tape and Reel; Min Operating Temperature: -55°C; Number of Terminations: 2; Length: 1.6mm; RoHS Compliant: Yes; Contact Plating: Tin; Construction: Rectangular; Radiation Hardening: No; Width: 0.8mm; Power Rating: 100mW; Ratings: AEC-Q200; Termination: SMD/SMT; Resistor Type: Thick Film; Weight: 7.1E-05oz; Case Code (Metric): 1608; Military Standard: Not; Case Code (Imperial): 0603; Size Code: 0603; Features: Moisture Resistant; Case/Package: 0603; Supplier 1: Future Electronics; Supplier Part Number 1: 2026405
U?#4 = CMP-04918-000001-1: IC REG BCK BST ADJ 2A 15VQFN; Manufacturer: Texas Instruments; Number Of Outputs: 1; Max Duty Cycle: 100%; Output Type: AdjustableProgrammable; Max Supply Voltage: 16V; Max Junction Temp: +125°C; Switching Topology: Buck-Boost; Output Voltage: 2.5-9V; Standoff Height: 0mm; Min Supply Voltage: 2V; Switching Frequency: 2400kHz; Nominal Supply Current: 5-54uA; Temperature: -40°C to +125°C; Manufacturer Part Number: TPS63070RNMT; Device Class L1: Integrated Circuits (ICs); RoHS: TRUE; Package: RNM0015A; Octopart: https://octopart.com/tps63070rnmt-texas+instruments-75117739; Output Current: 2A; Device Class L3: Voltage Regulators - Switching; Temperature Range High: +125°C; ComponentLink2Description: Datasheet; ComponentLink2URL: http://www.ti.com/lit/ds/symlink/tps63070.pdf; Lead Free: Yes; Device Class L2: Power Management ICs; Automotive: No; Height: 1mm; Temperature Range Low: -40°C; Category: IC; Digikey Description: IC REG BCK BST ADJ 2A 15VQFN; Supplier 1: Mouser; Supplier Part Number 1: 595-TPS63070RNMT
U?#5 = CMP-0592-00001-4: IC REG LINEAR 5V 1A SOT223; Output Voltage Accuracy: 1%; Number of Outputs: 1; Dropout Voltage: 1.2V; Polarity: Positive; Power Rating: 781mW; Input Bias Current: 6mA; Quiescent Current: 10mA; Output Type: Fixed; Max Input Voltage: 20V; Min Input Voltage: 3.5V; Max Operating Temperature: 125°C; Number of Pins: 4; Case/Package: SOT-223; Min Operating Temperature: 0°C; Accuracy: 1%; Contact Plating: Tin; Min Current Limit: 1A; Output Current: 1A; Max Output Current: 1A; Length: 6.7mm; Packaging: Tape and Reel; Package Quantity: 1; Height: 1.69mm; REACH SVHC: No SVHC; Width: 3.7mm; Halogen Free: Halogen Free; RoHS Compliant: Yes; Nominal Output Voltage: 5V; Lead Free: Lead Free; Radiation Hardening: No; Tolerance: 1%; Number of Regulators: 1; Output Voltage: 5V; Supplier 1: Digikey; Supplier Part Number 1: NCP1117ST50T3GOSCT-ND

## Sheet M7_DSP_Top_Sheet.SchDoc
size A3; SheetNumber: 1; SheetTotal: 4

## Sheet M7_DSP_Codec.SchDoc
size A3; SheetNumber: 5; SheetTotal: 5
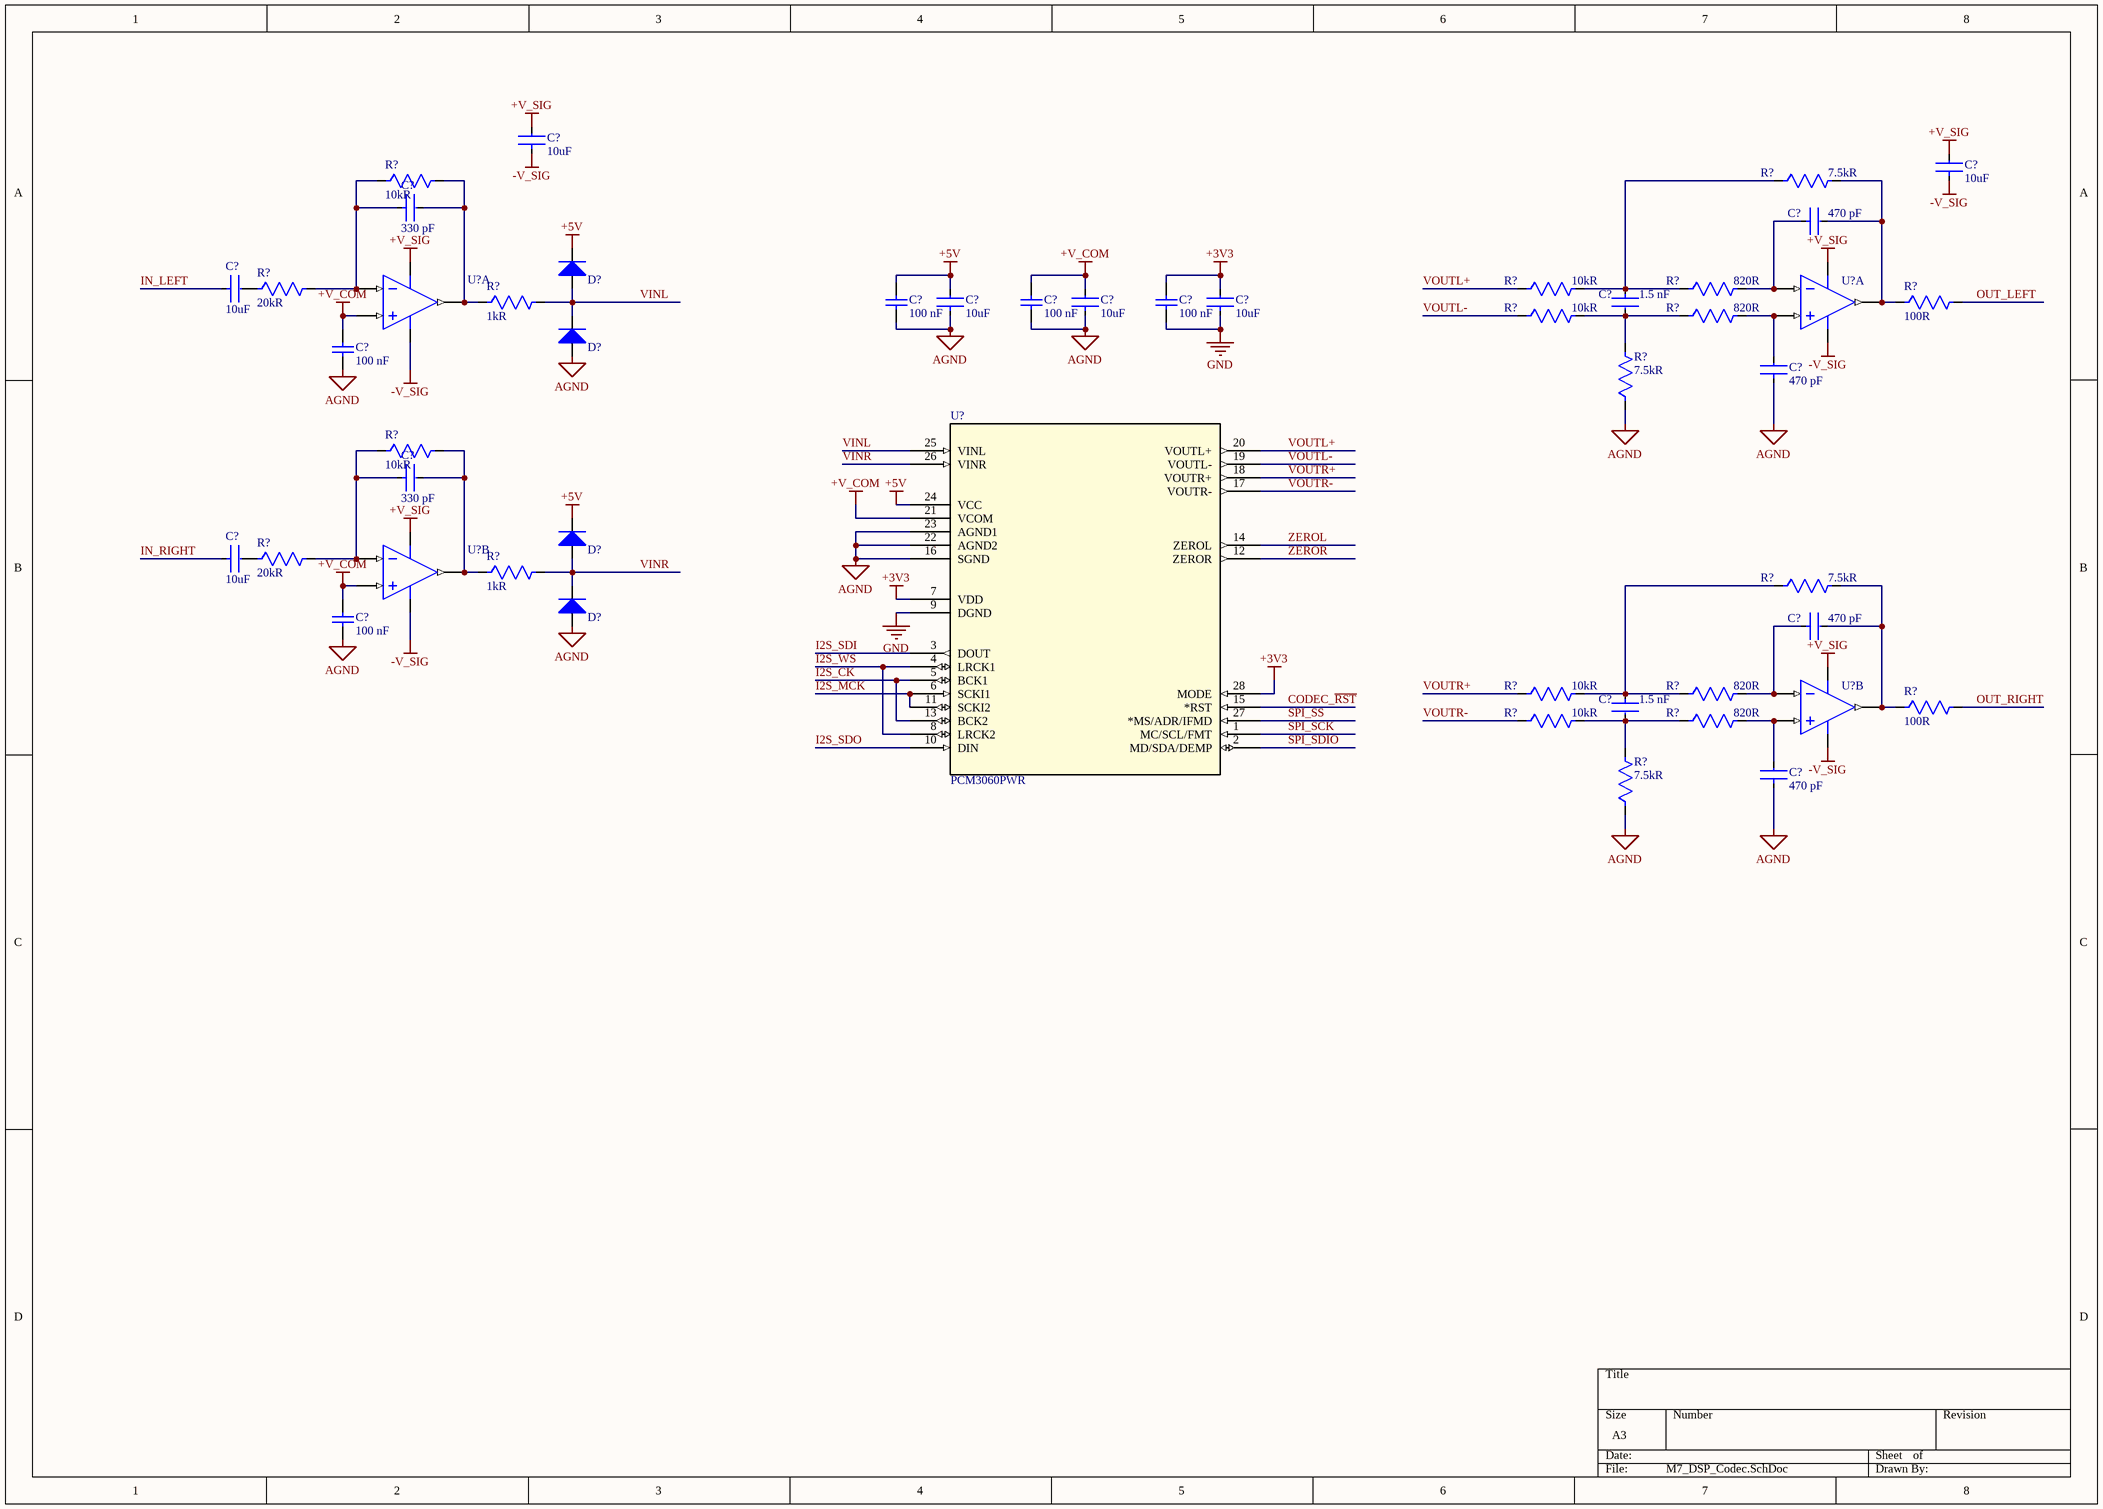
[diagram p3: M7_DSP_Codec.SchDoc]

### Parts
(Parts that share a designator on the sheet are numbered #1, #2 ... from top to bottom, then left to right.)
C?#28  Capacitance: 10uF  [FP-0603-L_1_6_0_2-W_0_8_0-MFG]  (hidden comment: TMK107BBJ106MA-T)
C?#29  Capacitance: 10uF  [FP-0603-L_1_6_0_2-W_0_8_0-MFG]  (hidden comment: TMK107BBJ106MA-T)
C?#30  value 330 pF  [FP-C0603C-CF-IPC_B]  (hidden comment: C0603C331F5GACTU)
C?#31  Capacitance: 470 pF  [FP-C0603C-CF-IPC_B]  (hidden comment: C0603C471F5GACTU)
C?#32  Capacitance: 100 nF  [CAPC1608X90X40ML10T20]  (hidden comment: CC0603ZRY5V9BB104)
C?#33  Capacitance: 100 nF  [CAPC1608X90X40ML10T20]  (hidden comment: CC0603ZRY5V9BB104)
C?#34  Capacitance: 100 nF  [CAPC1608X90X40ML10T20]  (hidden comment: CC0603ZRY5V9BB104)
C?#35  value 10uF  [FP-GRM21B-0_2-e0_2_0_7-MFG]  (hidden comment: GRM21BC71E106ME11L)
C?#36  Capacitance: 1.5 nF  [FP-C0603C-CF-IPC_B]  (hidden comment: C0603C152F5GACTU)
C?#37  Capacitance: 10uF  [FP-0603-L_1_6_0_2-W_0_8_0-MFG]  (hidden comment: TMK107BBJ106MA-T)
C?#38  Capacitance: 10uF  [FP-0603-L_1_6_0_2-W_0_8_0-MFG]  (hidden comment: TMK107BBJ106MA-T)
C?#39  Capacitance: 10uF  [FP-0603-L_1_6_0_2-W_0_8_0-MFG]  (hidden comment: TMK107BBJ106MA-T)
C?#40  Capacitance: 100 nF  [CAPC1608X90X40ML10T20]  (hidden comment: CC0603ZRY5V9BB104)
C?#41  Capacitance: 470 pF  [FP-C0603C-CF-IPC_B]  (hidden comment: C0603C471F5GACTU)
C?#42  value 330 pF  [FP-C0603C-CF-IPC_B]  (hidden comment: C0603C331F5GACTU)
C?#43  value 10uF  [FP-GRM21B-0_2-e0_2_0_7-MFG]  (hidden comment: GRM21BC71E106ME11L)
C?#44  Capacitance: 100 nF  [CAPC1608X90X40ML10T20]  (hidden comment: CC0603ZRY5V9BB104)
C?#45  Capacitance: 470 pF  [FP-C0603C-CF-IPC_B]  (hidden comment: C0603C471F5GACTU)
C?#46  Capacitance: 1.5 nF  [FP-C0603C-CF-IPC_B]  (hidden comment: C0603C152F5GACTU)
C?#47  Capacitance: 470 pF  [FP-C0603C-CF-IPC_B]  (hidden comment: C0603C471F5GACTU)
D?#3  1N4148WT  [FAIR-SOD-523F-2_V]  (value not drawn)
D?#4  1N4148WT  [FAIR-SOD-523F-2_V]  (value not drawn)
D?#5  1N4148WT  [FAIR-SOD-523F-2_V]  (value not drawn)
D?#6  1N4148WT  [FAIR-SOD-523F-2_V]  (value not drawn)
R?#10  Resistance: 10kR  [FP-AC0603-MFG]  (hidden comment: AC0603FR-0710KL)
R?#11  Resistance: 7.5kR  [FP-AC0603-IPC_C]  (hidden comment: AC0603FR-077K5L)
R?#12  Resistance: 20kR  [FP-AC0603-IPC_C]  (hidden comment: AC0603FR-0720KL)
R?#13  Resistance: 10kR  [FP-AC0603-MFG]  (hidden comment: AC0603FR-0710KL)
R?#14  Resistance: 820R  [FP-AC0603-IPC_C]  (hidden comment: AC0603FR-07820RL)
R?#15  Resistance: 1kR  [FP-AC0603-IPC_C]  (hidden comment: AC0603FR-071KL)
R?#16  Resistance: 100R  [FP-AC0603-MFG]  (hidden comment: AC0603FR-07100RL)
R?#17  Resistance: 10kR  [FP-AC0603-MFG]  (hidden comment: AC0603FR-0710KL)
R?#18  Resistance: 820R  [FP-AC0603-IPC_C]  (hidden comment: AC0603FR-07820RL)
R?#19  Resistance: 7.5kR  [FP-AC0603-IPC_C]  (hidden comment: AC0603FR-077K5L)
R?#20  Resistance: 10kR  [FP-AC0603-MFG]  (hidden comment: AC0603FR-0710KL)
R?#21  Resistance: 20kR  [FP-AC0603-IPC_C]  (hidden comment: AC0603FR-0720KL)
R?#22  Resistance: 1kR  [FP-AC0603-IPC_C]  (hidden comment: AC0603FR-071KL)
R?#23  Resistance: 7.5kR  [FP-AC0603-IPC_C]  (hidden comment: AC0603FR-077K5L)
R?#24  Resistance: 10kR  [FP-AC0603-MFG]  (hidden comment: AC0603FR-0710KL)
R?#25  Resistance: 820R  [FP-AC0603-IPC_C]  (hidden comment: AC0603FR-07820RL)
R?#26  Resistance: 100R  [FP-AC0603-MFG]  (hidden comment: AC0603FR-07100RL)
R?#27  Resistance: 10kR  [FP-AC0603-MFG]  (hidden comment: AC0603FR-0710KL)
R?#28  Resistance: 820R  [FP-AC0603-IPC_C]  (hidden comment: AC0603FR-07820RL)
R?#29  Resistance: 7.5kR  [FP-AC0603-IPC_C]  (hidden comment: AC0603FR-077K5L)
U?#6  TL072HIDR  [D0008A_N]  (value not drawn)  (part A of 2)
U?#7  TL072HIDR  [D0008A_N]  (value not drawn)  (part A of 2)
U?#8  TL072HIDR  [D0008A_N]  (value not drawn)  (part B of 2)
U?#9  TL072HIDR  [D0008A_N]  (value not drawn)  (part B of 2)
U?#10  PCM3060PWR  [PW28]

### Nets
+3V3: C?#34.1 C?#39.2 U?#10.7(VDD) U?#10.28(MODE)
+5V: C?#32.1 C?#37.2 D?#3.1(K) D?#5.1(K) U?#10.24(VCC)
+V_COM: C?#33.1 C?#38.2 C?#40.1 C?#44.1 U?#6.3(IN1+) U?#8.5(IN2+) U?#10.21(VCOM)
+V_SIG: C?#28.2 C?#29.2 U?#6.8(VCC+) U?#7.8(VCC+) U?#8.8(VCC+) U?#9.8(VCC+)
-V_SIG: C?#28.1 C?#29.1 U?#6.4(VCC-) U?#7.4(VCC-) U?#8.4(VCC-) U?#9.4(VCC-)
AGND: C?#32.2 C?#33.2 C?#34.2 C?#37.1 C?#38.1 C?#39.1 C?#40.2 C?#41.1 C?#44.2 C?#47.1 D?#4.2(A) D?#6.2(A) R?#19.1 R?#29.1 U?#10.9(DGND) U?#10.16(SGND) U?#10.22(AGND2) U?#10.23(AGND1)  [also labelled GND]
CODEC_~{RST}: U?#10.15(*RST)
I2S_CK: U?#10.5(BCK1) U?#10.13(BCK2)
I2S_MCK: U?#10.6(SCKI1) U?#10.11(SCKI2)
I2S_SDI: U?#10.3(DOUT)
I2S_SDO: U?#10.10(DIN)
I2S_WS: U?#10.4(LRCK1) U?#10.8(LRCK2)
IN_LEFT: C?#35.1
IN_RIGHT: C?#43.1
OUT_LEFT: R?#16.2
OUT_RIGHT: R?#26.2
SPI_~{SS}: U?#10.27(*MS/ADR/IFMD)
SPI_SCK: U?#10.1(MC/SCL/FMT)
SPI_SDIO: U?#10.2(MD/SDA/DEMP)
VINL: D?#3.2(A) D?#4.1(K) R?#15.2 U?#10.25(VINL)
VINR: D?#5.2(A) D?#6.1(K) R?#22.2 U?#10.26(VINR)
VOUTL+: R?#13.1 U?#10.20(VOUTL+)
VOUTL-: R?#17.1 U?#10.19(VOUTL-)
VOUTR+: R?#24.1 U?#10.18(VOUTR+)
VOUTR-: R?#27.1 U?#10.17(VOUTR-)
ZEROL: U?#10.14(ZEROL)
ZEROR: U?#10.12(ZEROR)
NetC?#30_1: C?#30.1 R?#10.1 R?#12.2 U?#6.2(IN1-)
NetC?#30_2: C?#30.2 R?#10.2 R?#15.1 U?#6.1(OUT1)
NetC?#31_1: C?#31.1 R?#14.2 U?#7.2(IN1-)
NetC?#31_2: C?#31.2 R?#11.2 R?#16.1 U?#7.1(OUT1)
NetC?#35_2: C?#35.2 R?#12.1
NetC?#36_1: C?#36.1 R?#11.1 R?#13.2 R?#14.1
NetC?#36_2: C?#36.2 R?#17.2 R?#18.1 R?#19.2
NetC?#41_2: C?#41.2 R?#18.2 U?#7.3(IN1+)
NetC?#42_1: C?#42.1 R?#20.1 R?#21.2 U?#8.6(IN2-)
NetC?#42_2: C?#42.2 R?#20.2 R?#22.1 U?#8.7(OUT2)
NetC?#43_2: C?#43.2 R?#21.1
NetC?#45_1: C?#45.1 R?#25.2 U?#9.6(IN2-)
NetC?#45_2: C?#45.2 R?#23.2 R?#26.1 U?#9.7(OUT2)
NetC?#46_1: C?#46.1 R?#23.1 R?#24.2 R?#25.1
NetC?#46_2: C?#46.2 R?#27.2 R?#28.1 R?#29.2
NetC?#47_2: C?#47.2 R?#28.2 U?#9.5(IN2+)

### Library data of the parts
C?#28 C?#29 C?#37-C?#39 = CMP-14477-005164-2: as C?#15 on sheet M7_DSP_Power_Supply; Packaging: Tape and Reel; Tolerance: 20%; Mount: Surface Mount; Case Code (Metric): 1608; Case Code (Imperial): 0603; Min Operating Temperature: -55°C; Lead Free: Lead Free; RoHS Compliant: Yes; Case/Package: 0603; Max Operating Temperature: 85°C; Voltage Rating: 25V; Supplier 1: Rs; Supplier Part Number 1: 1782887
C?#30 C?#42 = CMP-1035-01569-3: CAP CER 330PF 50V 1% NP0 0603; Manufacturer: KEMET; Temperature Coefficient: 30ppm/°C; Temperature Characteristic: C0G; Material: Ceramic; Tolerance: 0.01; Automotive Grade: Grade 1; Voltage Rating: 50 V; Temperature: -55°C to +125°C; Temperature Range High: +125°C; ComponentLink2Description: Datasheet; Automotive: Yes; Octopart: https://octopart.com/c0603c331f5gactu-kemet-9142706; Temperature Range Low: -55°C; ComponentLink2URL: https://api.kemet.com/component-edge/download/datasheet/C0603C100J5GACAUTO.pdf; Device Class L1: Passive Components; Mouser Description: Multilayer Ceramic Capacitors MLCC - SMD/SMT 50volts 330pF C0G 1%; Capacitance: 330 pF; Device Class L3: Ceramic Capacitors; Manufacturer Part Number: C0603C331F5GACTU; Height: 0.87mm; RoHS: TRUE; Device Class L2: Capacitors; Package: C0603C-CF; Digikey Description: CAP CER 330PF 50V 1% NP0 0603; Category: Cap; Lead Free: Yes; Supplier 1: Mouser; Supplier Part Number 1: 80-C0603C331F5G
C?#31 C?#41 C?#45 C?#47 = CMP-2006-03206-2: CAP CER 470PF 50V 1% NP0 0603; Manufacturer: KEMET; Temperature Coefficient: 30ppm/°C; Tolerance: 0.01; Temperature Characteristic: C0G; Automotive Grade: Grade 1; Material: Ceramic; Temperature Range Low: -55°C; ComponentLink2Description: Datasheet; Digikey Description: CAP CER 470PF 50V 1% NP0 0603; Manufacturer Part Number: C0603C471F5GACTU; Device Class L1: Passive Components; Category: Cap; ComponentLink2URL: https://api.kemet.com/component-edge/download/datasheet/C0603C100J5GACAUTO.pdf; Automotive: Yes; Package: C0603C-CF; Value: 470 pF; Octopart: https://octopart.com/c0603c471f5gactu-kemet-9143748; Device Class L3: Ceramic Capacitors; Device Class L2: Capacitors; Temperature Range High: +125°C; RoHS: TRUE; Lead Free: Yes; Height: 0.87mm; Voltage Rating: 50 V; Temperature: -55°C to +125°C; Mouser Description: Cap Ceramic 470pF 50V C0G 1% SMD 0603 125°C Paper T/R; Supplier 1: Mouser; Supplier Part Number 1: 80-C0603C471F5G
C?#32-C?#34 C?#40 C?#44 = CMP-1035-02594-2: as C?#3 on sheet M7_DSP_MCU_Power; Mounting Type: SurfaceMount,MLCC; Package Description: 2-Pin Surface Mount Device, Body 1.6 x 0.8 mm; Ratings: -; Lead Spacing: -; Standard Package: 1; Applications: GeneralPurpose; Size / Dimension: 0.063"Lx0.031"W(1.60mmx0.80mm); Package Reference: 0603; Operating Temperature: -30°C~85°C; Features: -; Height - Seated (Max): -; Thickness (Max): 0.035"(0.90mm); Series: CC; Datasheet URL: https://datasheet.ciiva.com/17434/upy-gphc-y5v-6-3v-to-50v-5-17434523.pdf; Family: CeramicCapacitors; Mounting Technology: SurfaceMount; Packaging: CutTape(CT); Package / Case: 0603(1608Metric); Manufacturer URL: http://www.yageo.com/; Category: Capacitors; Lead Style: -; Datasheet Version: Rev. 5, 07/2010; Supplier 1: Rs; Supplier Part Number 1: 6169565
C?#35 C?#43 = GRM21BC71E106ME11L: as C?#14 on sheet M7_DSP_MCU_Power; Manufacturer Part Number: GRM21BC71E106ME11L; RoHS: Yes; Category: Ceramic Capacitors; Stock 1: 6000; Pricing 1: 3000=0.1097, 9000=0.0994, 24000=0.097, 45000=0.0923 (USD); Mounting Technology: Surface Mount; Case/Package: 0805; Case Code (Metric): 2012; Case Code (Imperial): 0805; Weight: 0.000335oz; Min Operating Temperature: -55°C; Max Operating Temperature: 125°C; Packaging: Tape and Reel; Termination: SMD/SMT; Voltage Rating (DC): 25V; Package Quantity: 3000; Series: GRM; Length: 0.079inch; Width: 0.049inch; Height: 1.25mm; Thickness: 0.057inch; RoHS Compliant: Yes; ComponentLink1URL: http://www.mouser.com/ds/2/281/c02e-2905.pdf?src-supplier=Mouser; ComponentLink1Description: http://www.mouser.com/ds/2/281/c02e-2905.pdf?src-supplier=Mouser; ComponentLink2URL: http://search.murata.co.jp/Ceramy/image/img/A01X/G101/ENG/GRM21BC71E106ME11-01.pdf?src-supplier=Digikey; ComponentLink2Description: http://search.murata.co.jp/Ceramy/image/img/A01X/G101/ENG/GRM21BC71E106ME11-01.pdf?src-supplier=Digikey; ComponentLink3URL: http://search.murata.co.jp/Ceramy/image/img/A01X/partnumbering_e_01.pdf?src-supplier=Digikey; ComponentLink3Description: http://search.murata.co.jp/Ceramy/image/img/A01X/partnumbering_e_01.pdf?src-supplier=Digikey; ComponentLink4URL: https://datasheet.octopart.com/GRM21BC71E106ME11L-Murata-datasheet-149523451.pdf?src-supplier=Newark; ComponentLink4Description: https://datasheet.octopart.com/GRM21BC71E106ME11L-Murata-datasheet-149523451.pdf?src-supplier=Newark; ComponentLink5URL: https://datasheet.octopart.com/GRM21BC71E106ME11L-Murata-datasheet-32479577.pdf?src-supplier=Future+Electronics; ComponentLink5Description: https://datasheet.octopart.com/GRM21BC71E106ME11L-Murata-datasheet-32479577.pdf?src-supplier=Future+Electronics; Supplier Part Number 1: GRM21BC71E106ME11L; Supplier 1: Arrow Electronics
C?#36 C?#46 = CMP-1035-01960-3: Cap Ceramic 0.0015uF 50V C0G 1% SMD 0603 125°C Punched Paper T/R; Manufacturer: KEMET; Automotive Grade: Grade 1; Temperature Coefficient: 30ppm/°C; Tolerance: 0.01; Value: 1.5 nF; ComponentLink2Description: Datasheet; Lead Free: Yes; Digikey Description: Cap Ceramic 0.0015uF 50V C0G 1% SMD 0603 125°C Punched Paper T/R; Temperature: -55°C to +125°C; Voltage Rating: 50 V; Category: Cap; Device Class L2: Capacitors; Temperature Range Low: -55°C; Temperature Characteristic: C0G; Package: C0603C-CF; Manufacturer Part Number: C0603C152F5GACTU; Octopart: https://octopart.com/c0603c152f5gactu-kemet-10304761; ComponentLink2URL: https://api.kemet.com/component-edge/download/datasheet/C0603C100J5GACAUTO.pdf; Material: Ceramic; Automotive: Yes; RoHS: TRUE; Device Class L1: Passive Components; Device Class L3: Ceramic Capacitors; Mouser Description: Cap Ceramic 0.0015uF 50V C0G 1% SMD 0603 125°C Punched Paper T/R; Height: 0.87mm; Temperature Range High: +125°C; Supplier 1: Mouser; Supplier Part Number 1: 80-C0603C152F5G
D?#3-D?#6 = CMP-0881-00001-1: High Conductance Fast Switching Diode, 75 V, -55 to 150 degC, 2-Pin SOD523F, RoHS; Manufacturer: Fairchild Semiconductor; IR (VR: 75 V)=5 uA Max.; VF: 1 V Max.; BVR (IR: 5 uA)=75 V Min.; CO: 4 pF Max.; DatasheetVersion: Rev. A2; ComponentLink1Description: Manufacturer URL; PackageDescription: 2-Pin Surface Mount Device, Body 1.2 x 0.8 mm, Height 0.7 mm; ComponentLink2URL: http://www.fairchildsemi.com/ds/1N/1N4148WT.pdf; ComponentLink2Description: Datasheet; PartNumber: 1N4148WT; ComponentLink1URL: http://www.fairchildsemi.com/; Temperature Range: -55 to 150 degC; Mounting Technology: Surface Mount; PackageReference: SOD-523F-2; RoHS: TRUE; Supplier 1: Future Electronics; Supplier Part Number 1: 4906632
R?#10 R?#13 R?#17 R?#20 R?#24 R?#27 = CMP-2000-04818-3: as R?#1 on sheet M7_DSP_MCU_IO; Ratings: AEC-Q200; Case Code (Metric): 1608; Max Power Dissipation: 100mW; Height: 0.45mm; Package Quantity: 1; Max Operating Temperature: 155°C; Resistor Type: Thick Film; Depth: 0.8mm; RoHS Compliant: Yes; Min Operating Temperature: -55°C; Packaging: Tape and Reel; Number of Terminations: 2; Length: 1.6mm; Features: Moisture Resistant; Military Standard: Not; Case Code (Imperial): 0603; Size Code: 0603; Termination: SMD/SMT; Case/Package: 0603; Mount: Surface Mount; Width: 0.8mm; Lead Free: Lead Free; Series: AC; Construction: Rectangular; Supplier 1: Future Electronics; Supplier Part Number 1: 2029400
R?#11 R?#19 R?#23 R?#29 = CMP-03412-008671-2: RES 7.5KΩ 1.00% 0.1W 0603; Voltage Rating: 50V; Tolerance: 1%; Max Power Dissipation: 100mW; Temperature Coefficient: 100ppm/°C; Case Code (Imperial): 0603; RoHS Compliant: Yes; Height: 0.45mm; Resistor Type: Thick Film; Number of Terminations: 2; Termination: SMD/SMT; Packaging: Tape and Reel; Length: 1.6mm; Width: 0.8mm; Min Operating Temperature: -55°C; Lead Free: Lead Free; Case/Package: 0603; Features: Moisture Resistant; Ratings: AEC-Q200; Power Rating: 100mW; Max Operating Temperature: 155°C; Case Code (Metric): 1608; Series: AC; Supplier 1: Future Electronics; Supplier Part Number 1: 7029296
R?#12 R?#21 = CMP-2000-04831-3: RES 20KΩ 1.00% 0.1W 0603; Power Rating: 100mW; Temperature Coefficient: 100ppm/°C; Tolerance: 1%; Voltage Rating: 50V; Width: 0.8mm; Case Code (Metric): 1608; Max Operating Temperature: 155°C; Ratings: AEC-Q200; Min Operating Temperature: -55°C; Number of Terminations: 2; RoHS Compliant: Yes; Resistor Type: Thick Film; Height: 0.45mm; Lead Free: Lead Free; Max Power Dissipation: 100mW; Case Code (Imperial): 0603; Case/Package: 0603; Length: 1.6mm; Features: Moisture Resistant; Series: AC; Termination: SMD/SMT; Packaging: Tape and Reel; Supplier 1: Future Electronics; Supplier Part Number 1: 5026404
R?#14 R?#18 R?#25 R?#28 = CMP-2000-04854-3: RES 820Ω 1.00% 0.1W 0603; Temperature Coefficient: 100ppm/°C; Working Voltage: 75V; Tolerance: 1%; Voltage Rating: 50V; Max Power Dissipation: 100mW; Case/Package: 0603; Resistor Type: Thick Film; Ratings: AEC-Q200; Length: 1.6mm; Mount: Surface Mount; Width: 0.8mm; Height: 0.45mm; Case Code (Metric): 1608; RoHS Compliant: Yes; Technology: THICK FILM; Packaging: Tape and Reel; Lead Free: Lead Free; Max Operating Temperature: 155°C; Features: Moisture Resistant; Number of Terminations: 2; Series: AC; Case Code (Imperial): 0603; Moisture Sensitivity Level: 1; Min Operating Temperature: -55°C; Power Rating: 100mW; Termination: SMD/SMT; Supplier 1: Future Electronics; Supplier Part Number 1: 8029296
R?#15 R?#22 = CMP-2000-04828-3: RES 1kΩ 1.00% 0.1W 0603; Voltage Rating: 50V; Power Rating: 100mW; Tolerance: 1%; Temperature Coefficient: 100ppm/°C; Depth: 0.8mm; Case/Package: 0603; Size Code: 0603; Case Code (Metric): 1608; Height: 0.022inch; Series: AC; Width: 0.031inch; Construction: Rectangular; Length: 0.063inch; Case Code (Imperial): 0603; Package Quantity: 1; RoHS Compliant: Yes; Features: Moisture Resistant; Resistor Type: Thick Film; Max Power Dissipation: 100mW; Packaging: Tape and Reel; Termination: SMD/SMT; Ratings: AEC-Q200; Max Operating Temperature: 155°C; Min Operating Temperature: -55°C; Military Standard: Not; Lead Free: Lead Free; Number of Terminations: 2; Supplier 1: Future Electronics; Supplier Part Number 1: 1029290
R?#16 R?#26 = CMP-2000-04817-3: as R?#8 on sheet M7_DSP_Power_Supply; Series: AC; Height: 0.45mm; Max Operating Temperature: 155°C; Depth: 0.8mm; Lead Free: Lead Free; Packaging: Tape and Reel; Min Operating Temperature: -55°C; Number of Terminations: 2; Length: 1.6mm; RoHS Compliant: Yes; Contact Plating: Tin; Construction: Rectangular; Radiation Hardening: No; Width: 0.8mm; Power Rating: 100mW; Ratings: AEC-Q200; Termination: SMD/SMT; Resistor Type: Thick Film; Weight: 7.1E-05oz; Case Code (Metric): 1608; Military Standard: Not; Case Code (Imperial): 0603; Size Code: 0603; Features: Moisture Resistant; Case/Package: 0603; Supplier 1: Future Electronics; Supplier Part Number 1: 2026405
U?#6-U?#9 = TL072HIDR: Dual-channel low input bias current standard op amp 8-SOIC -40 to 125; Manufacturer: Texas Instruments; Supplier 1: Mouser; Manufacturer Part Number: TL072HIDR; RoHS: No; Category: Amplifiers - Op Amps, Buffer, Instrumentation; Stock 1: 665; Pricing 1: 1=0.37, 10=0.299, 50=0.299, 100=0.204, 1000=0.125, 10000=0.106 (USD); Supplier Part Number 1: 595-TL072HIDR
U?#10 = PCM3060PWR: 24-bit Asynchronous Stereo Audio Codec with 96/192kHz sampling rate 28-TSSOP -25 to 85; Mfr_Name: Texas Instruments; Interface: Serial,I2C,SPI,2-Wire,3-WIRE; Min Supply Voltage: 4.5V; Operating Supply Voltage: 5V; Max Supply Voltage: 5.5V; Resolution: 24b; Number of A/D Converters: 1; Sampling Rate: 192KS/s; Signal to Noise Ratio (SNR): 99dB; Power Consumption: 160mW; Number of ADC Channels: 2; Copyright: Copyright (C) 2024 Ultra Librarian. All rights reserved.; Manufacturer_Part_Number: PCM3060PWR; RefDes: RefDes; Type: DEV; Supplier 1: Mouser; Manufacturer: Texas Instruments; Manufacturer Part Number: PCM3060PWR; RoHS: Yes; Category: Amplifiers - Audio; Stock 1: 9554; Pricing 1: 1=4.7, 10=4.19, 50=4.19, 100=3.85, 1000=3.08, 10000=2.92 (USD); Case/Package: TSSOP; Pins: 28; Weight: 0.004145oz; Min Operating Temperature: -25°C; Max Operating Temperature: 85°C; Packaging: Tape and Reel; Package Quantity: 2000; Number of D/A Converters: 1; Number of Analog Inputs: 2; Number of DAC Channels: 2; Number of Analog Outputs: 2; Series: -; Radiation Hardening: No; Lead Free: Lead Free; RoHS Compliant: Yes; ComponentLink1URL: https://datasheet.ciiva.com/1693/pcm3060-1693338.pdf?src-supplier=Digikey; ComponentLink1Description: https://datasheet.ciiva.com/1693/pcm3060-1693338.pdf?src-supplier=Digikey; ComponentLink2URL: https://datasheet.ciiva.com/3027/pcm3060-3027369.pdf?src-supplier=Avnet; ComponentLink2Description: https://datasheet.ciiva.com/3027/pcm3060-3027369.pdf?src-supplier=Avnet; Supplier Part Number 1: 595-PCM3060PWR